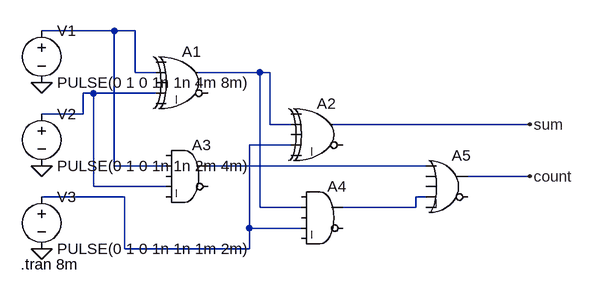
[diagram p0: schematic FULL ADDER.asc]
FULL ADDER.asc, the LTspice schematic file:
Version 4.1
SHEET 1 880 680
WIRE 80 48 -32 48
WIRE 112 48 80 48
WIRE 112 112 112 48
WIRE 144 112 112 112
WIRE 304 112 208 112
WIRE 320 112 304 112
WIRE 48 144 32 144
WIRE 144 144 48 144
WIRE 32 176 32 144
WIRE 32 176 -32 176
WIRE 320 192 320 112
WIRE 352 192 320 192
WIRE 720 192 416 192
WIRE 352 224 288 224
WIRE 80 256 80 48
WIRE 160 256 80 256
WIRE 560 256 224 256
WIRE 720 272 624 272
WIRE 48 288 48 144
WIRE 160 288 48 288
WIRE 96 304 -32 304
WIRE 560 304 544 304
WIRE 304 320 304 112
WIRE 368 320 304 320
WIRE 544 320 544 304
WIRE 544 320 432 320
WIRE 288 352 288 224
WIRE 368 352 288 352
WIRE 96 384 96 304
WIRE 288 384 288 352
WIRE 288 384 96 384
FLAG -32 128 0
FLAG -32 256 0
FLAG -32 384 0
FLAG 720 192 sum
FLAG 720 272 count
SYMBOL voltage -32 32 R0
WINDOW 123 0 0 Left 0
WINDOW 39 0 0 Left 0
SYMATTR InstName V1
SYMATTR Value PULSE(0 1 0 1n 1n 4m 8m)
SYMBOL voltage -32 160 R0
WINDOW 123 0 0 Left 0
WINDOW 39 0 0 Left 0
SYMATTR InstName V2
SYMATTR Value PULSE(0 1 0 1n 1n 2m 4m)
SYMBOL voltage -32 288 R0
WINDOW 123 0 0 Left 0
WINDOW 39 0 0 Left 0
SYMATTR InstName V3
SYMATTR Value PULSE(0 1 0 1n 1n 1m 2m)
SYMBOL Digital\\xor 192 64 R0
SYMATTR InstName A1
SYMBOL Digital\\xor 400 144 R0
SYMATTR InstName A2
SYMBOL Digital\\and 192 208 R0
SYMATTR InstName A3
SYMBOL Digital\\and 400 272 R0
SYMATTR InstName A4
SYMBOL Digital\\or 592 224 R0
SYMATTR InstName A5
TEXT -64 408 Left 2 !.tran 8m

The netlist it stands for:
* FULL ADDER.asc
V1 N001 0 PULSE(0 1 0 1n 1n 4m 8m)
V2 N003 0 PULSE(0 1 0 1n 1n 2m 4m)
V3 N004 0 PULSE(0 1 0 1n 1n 1m 2m)
A1 0 N001 0 N003 0 0 N002 0 XOR
A2 0 N002 0 N004 0 0 sum 0 XOR
A3 0 N001 0 N003 0 0 N005 0 AND
A4 0 N002 0 N004 0 0 N006 0 AND
A5 N005 0 0 N006 0 0 count 0 OR
.tran 8m
.backanno
.end